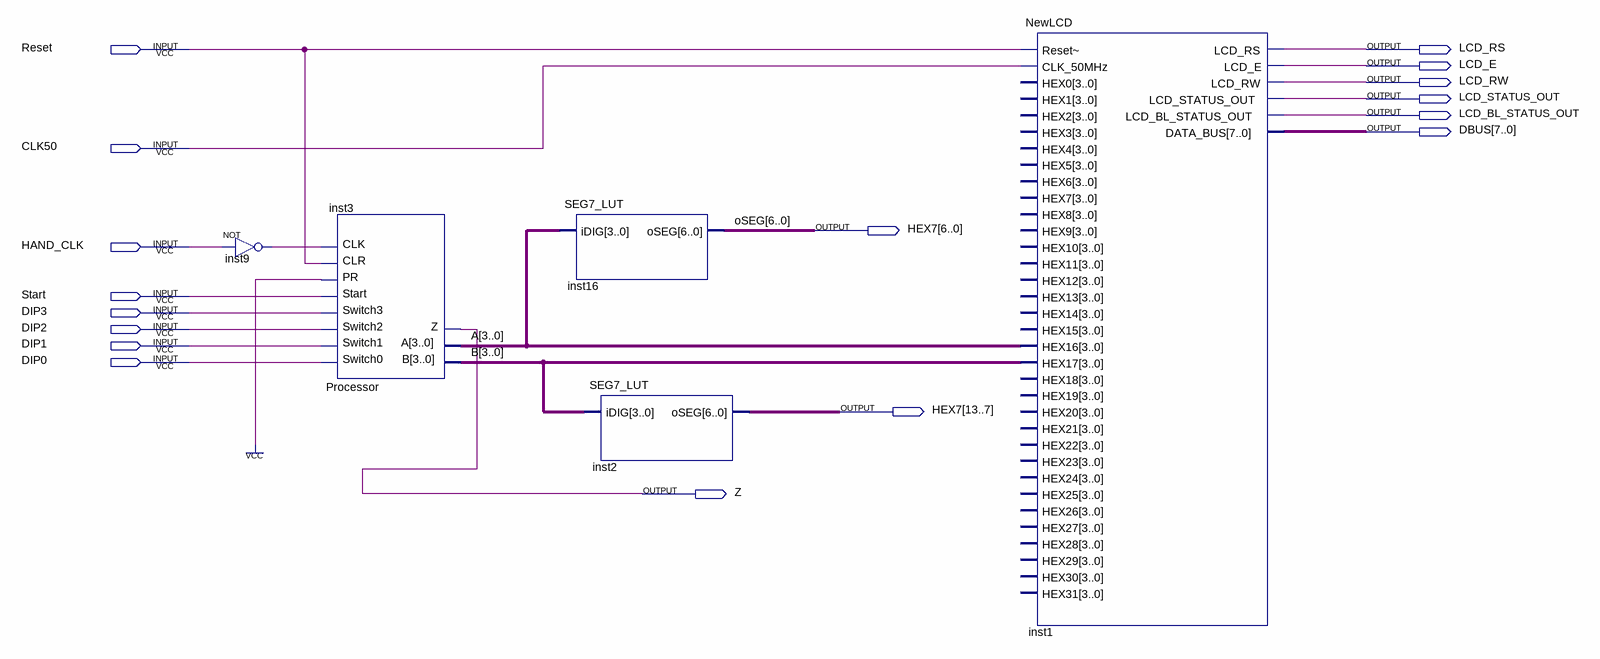
[diagram p0: schematic sheet]
// Quartus schematic ProcessorBoard.bdf as structural Verilog: 5 symbols, 17 pins
module ProcessorBoard (
  input  Reset,
  input  CLK50,
  input  HAND_CLK,
  input  Start,
  input  DIP3,
  input  DIP2,
  input  DIP1,
  input  DIP0,
  output LCD_RS,
  output LCD_E,
  output LCD_RW,
  output LCD_STATUS_OUT,
  output LCD_BL_STATUS_OUT,
  output [7:0] DBUS,
  output [13:0] HEX7,
  output Z
);

  wire inst9_out;
  wire [3:0] A, B;

  not inst9 (inst9_out, HAND_CLK);
  Processor inst3 (
    .Switch0(DIP0), .Switch1(DIP1), .Switch2(DIP2), .Switch3(DIP3), .Start(Start), .PR(1'b1), .CLR(Reset),
    .CLK(inst9_out), .B(B), .A(A), .Z(Z));
  SEG7_LUT inst16 (.iDIG(A), .oSEG(HEX7[6:0]));
  SEG7_LUT inst2 (.iDIG(B), .oSEG(HEX7[13:7]));
  NewLCD inst1 (
    .\Reset~ (Reset), .CLK_50MHz(CLK50), .HEX16(A), .HEX17(B), .LCD_RS(LCD_RS), .LCD_E(LCD_E),
    .LCD_RW(LCD_RW), .LCD_STATUS_OUT(LCD_STATUS_OUT), .LCD_BL_STATUS_OUT(LCD_BL_STATUS_OUT), .DATA_BUS(DBUS));  // open: HEX0, HEX1, HEX2, HEX3, HEX4, HEX5, HEX6, HEX7, HEX8, HEX9, HEX10, HEX11, HEX12, HEX13, HEX14, HEX15, HEX18, HEX19, HEX20, HEX21, HEX22, HEX23, HEX24, HEX25, HEX26, HEX27, HEX28, HEX29, HEX30, HEX31

  // Other names for the same wires on the sheet: oSEG[6:0] = HEX7[6:0]
endmodule
